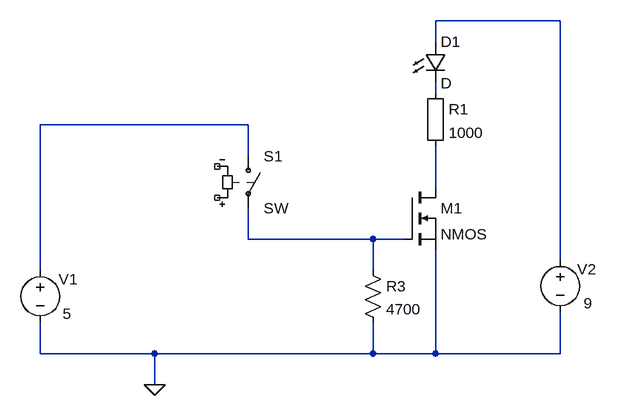
[diagram p0: schematic Dual voltage circuit.asc]
Dual voltage circuit.asc, the LTspice schematic file:
Version 4
SHEET 1 880 752
WIRE 608 176 416 176
WIRE 416 208 416 176
WIRE 416 288 416 272
WIRE 128 336 -192 336
WIRE 128 384 128 336
WIRE 416 432 416 368
WIRE 128 512 128 464
WIRE 320 512 128 512
WIRE 368 512 320 512
WIRE 608 544 608 176
WIRE -192 560 -192 336
WIRE 320 560 320 512
WIRE -192 688 -192 640
WIRE -16 688 -192 688
WIRE 320 688 320 640
WIRE 320 688 -16 688
WIRE 416 688 416 528
WIRE 416 688 320 688
WIRE 608 688 608 624
WIRE 608 688 416 688
WIRE -16 736 -16 688
FLAG -16 736 0
SYMBOL voltage -192 544 R0
WINDOW 0 43 45 Bottom 2
WINDOW 3 41 67 Top 2
SYMATTR InstName V1
SYMATTR Value 5
SYMBOL voltage 608 528 R0
WINDOW 0 41 46 Bottom 2
WINDOW 3 43 67 Top 2
SYMATTR InstName V2
SYMATTR Value 9
SYMBOL nmos 368 432 R0
SYMATTR InstName M1
SYMBOL Misc/EuropeanResistor 400 272 R0
SYMATTR InstName R1
SYMATTR Value 1000
SYMBOL res 304 544 R0
SYMATTR InstName R3
SYMATTR Value 4700
SYMBOL LED 400 208 R0
SYMATTR InstName D1
SYMBOL sw 128 368 R0
SYMATTR InstName S1

The netlist it stands for:
* Dual voltage circuit.asc
V1 N003 0 5
V2 N001 0 9
M1 N004 N005 0 0 NMOS
R1 N002 N004 1000
R3 N005 0 4700
D1 N001 N002 D
S1 N003 N005 NC_01 NC_02 SW
.model D D
.lib standard.dio
.model NMOS NMOS
.model PMOS PMOS
.lib standard.mos
.backanno
.end